# Altium project 红外发射模块.PrjPCB
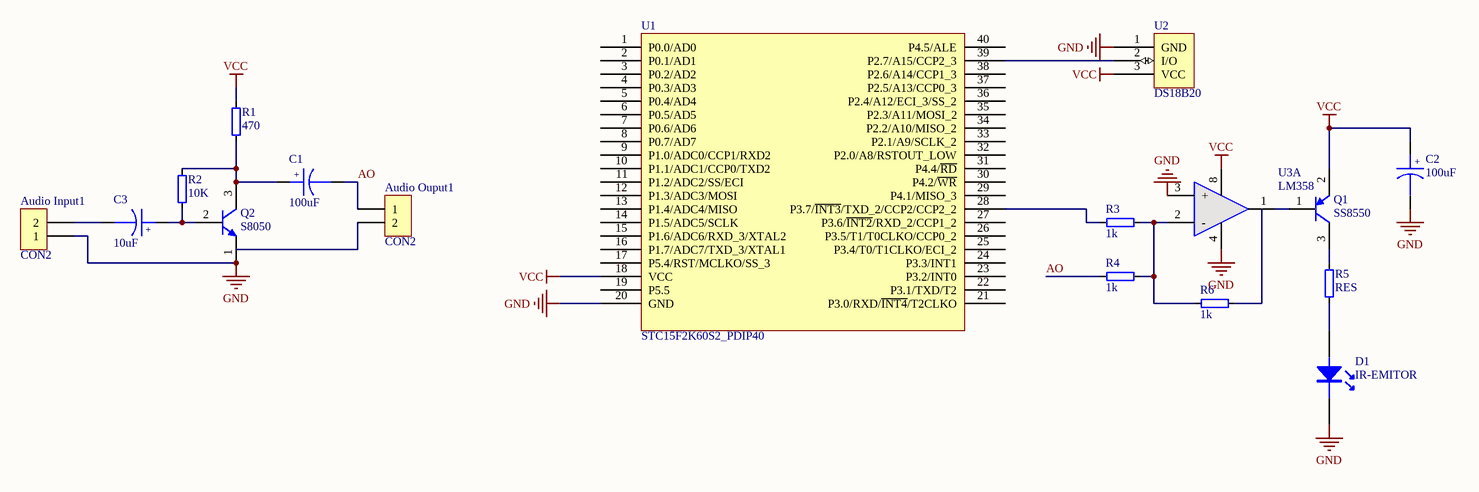
[diagram p0: 红外发射模块.SchDoc]
3 sheets, 35 parts. Net scope: global (net labels, ports and power ports of the same name join across sheets).
Sheets:
  红外发射模块.SchDoc
  红外接收模块.SchDoc
  中继转发.SchDoc

## Sheet 红外发射模块.SchDoc
size A4

### Parts
Audio_Input1  CON2
Audio_Ouput1  CON2
C1  100uF
C2  100uF
C3  10uF
D1  IR-EMITOR
Q1  SS8550  [SOT-23]
Q2  S8050  [TO-92A]
R1  470  [AXIAL0.3]
R2  10K  [AXIAL0.3]
R3  1k  [AXIAL0.3]
R4  1k  [AXIAL0.3]
R5  RES  [AXIAL0.3]
R6  1k  [AXIAL0.3]
U1  STC15F2K60S2_PDIP40  [DIP40]
U2  DS18B20
U3  LM358  [NSO8_N]  (part A of 2)

### Nets
GND: Audio_Input1.1 C2.2 D1.2 Q2.1(E) U1.20(GND) U2.1(GND) U3.3(+) U3.4(V-)
VCC: C2.1 Q1.2(E) R1.2 U1.18(VCC) U2.3(VCC) U3.8(V+)
AO: Audio_Ouput1.1 C1.2 R4.1
NetAudio_Input1_2: Audio_Input1.2 C3.2
NetC1_1: C1.1 Q2.3(C) R1.1 R2.2
NetC3_1: C3.1 Q2.2(B) R2.1
NetD1_1: D1.1 R5.1
NetQ1_1: Q1.1(B) U3.1(OUT1)
NetQ1_3: Q1.3(C) R5.2
NetR3_1: R3.1 U1.28(P3.7/~{INT3}/TXD_2/CCP2/CCP2_2)
NetR3_2: R3.2 R4.2 R6.1 U3.2(-)
NetU1_39: U1.39(P2.7/A15/CCP2_3) U2.2(I/O)

Not connected (* = marked no-connect by the designer): Audio_Ouput1 2; R6 2; U1 1(P0.0/AD0) 2(P0.1/AD1) 3(P0.2/AD2) 4(P0.3/AD3) 5(P0.4/AD4) 6(P0.5/AD5) 7(P0.6/AD6) 8(P0.7/AD7) 9(P1.0/ADC0/CCP1/RXD2) 10(P1.1/ADC1/CCP0/TXD2) 11(P1.2/ADC2/SS/ECI) 12(P1.3/ADC3/MOSI) 13(P1.4/ADC4/MISO) 14(P1.5/ADC5/SCLK) 15(P1.6/ADC6/RXD_3/XTAL2) 16(P1.7/ADC7/TXD_3/XTAL1) 17(P5.4/RST/MCLKO/SS_3) 19(P5.5) 21(P3.0/RXD/~{INT4}/T2CLKO) 22(P3.1/TXD/T2) 23(P3.2/INT0) 24(P3.3/INT1) 25(P3.4/T0/T1CLKO/ECI_2) 26(P3.5/T1/T0CLKO/CCP0_2) 27(P3.6/~{INT2}/RXD_2/CCP1_2) 29(P4.1/MISO_3) 30(P4.2/~{WR}) 31(P4.4/~{RD}) 32(P2.0/A8/RSTOUT_LOW) 33(P2.1/A9/SCLK_2) 34(P2.2/A10/MISO_2) 35(P2.3/A11/MOSI_2) 36(P2.4/A12/ECI_3/SS_2) 37(P2.5/A13/CCP0_3) 38(P2.6/A14/CCP1_3) 40(P4.5/ALE)

### Notes on the sheet
- (in symbol CAPACITOR POL) +

### Library data of the parts
Audio_Input1 Audio_Ouput1 = CON2: Connector
C1-C3 = CAPACITOR POL: Capacitor
Q1 = SS8550: PNP贴片三极管; Published: 8-Jun-2000; LatestRevisionDate: 15-Jan-2003; LatestRevisionNote: PCB Footprint 'BCY-W3/D4.7' replaced; DatasheetDocument: 1997; PackageDocument: Sep-1998; PackageReference: TO-92A; Publisher: Altium Limited; Code_JEDEC: TO-92A; ComponentLink1Description: Manufacturer Link; ComponentLink1URL: http://www.fairchildsemi.com/; ComponentLink2Description: Datasheet; ComponentLink2URL: http://www.fairchildsemi.com/ds/2N%2F2N3906.pdf
Q2 = S8050: NPN三极管; Published: 8-Jun-2000; LatestRevisionDate: 15-Jan-2003; LatestRevisionNote: PCB Footprint 'BCY-W3/D4.7' replaced; DatasheetDocument: 1997; PackageDocument: Sep-1998; PackageReference: TO-92A; Publisher: Altium Limited; Code_JEDEC: TO-92A; ComponentLink1Description: Manufacturer Link; ComponentLink1URL: http://www.fairchildsemi.com/; ComponentLink2Description: Datasheet; ComponentLink2URL: http://www.fairchildsemi.com/ds/2N%2F2N3904.pdf
R1-R4 R6 = RES
U3 = LM358: 双运放

## Sheet 红外接收模块.SchDoc
size A4
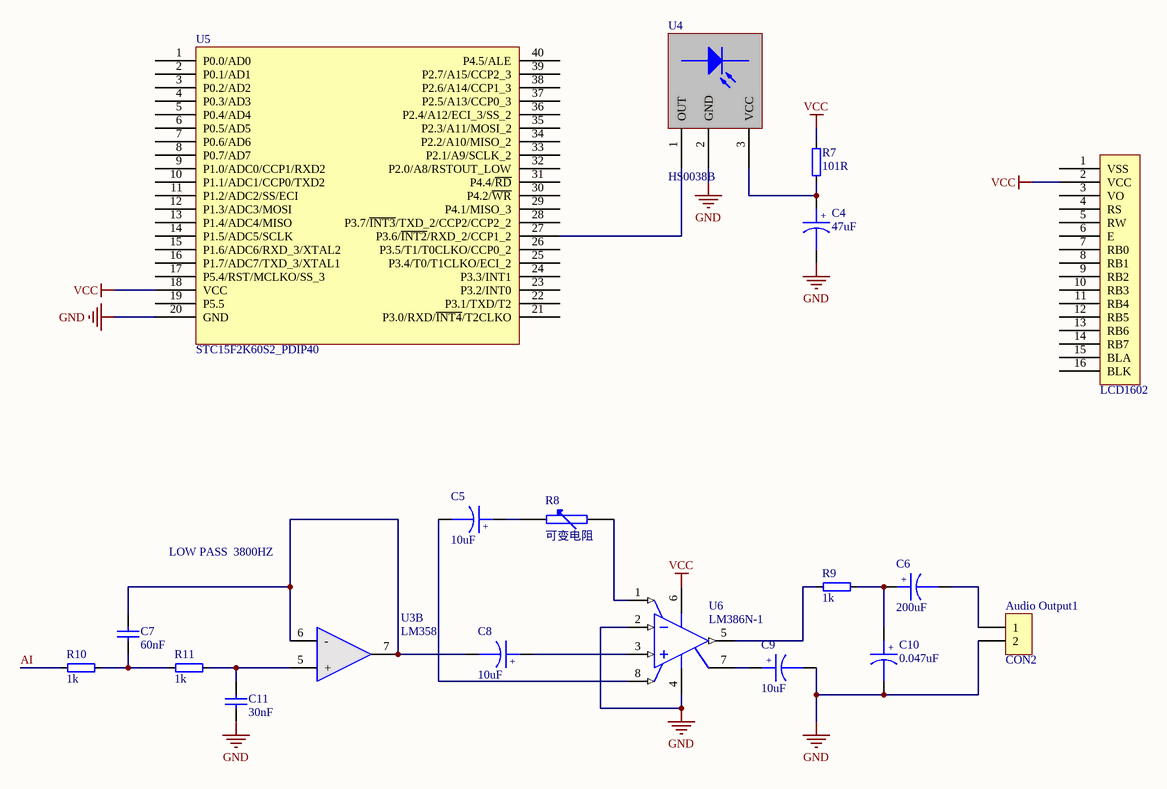
[diagram p1: 红外接收模块.SchDoc]

### Parts
?  LCD1602
Audio_Output1  CON2
C4  47uF
C5  10uF
C6  200uF
C7  value 60nF  [C-RAD-0603]  (hidden comment: Cap)
C8  10uF
C9  10uF
C10  0.047uF
C11  value 30nF  [C-RAD-0603]  (hidden comment: Cap)
R7  101R  [AXIAL0.3]
R8  可变电阻
R9  1k  [AXIAL0.3]
R10  1k  [AXIAL0.3]
R11  1k  [AXIAL0.3]
U3  LM358  [NSO8_N]  (part B of 2)
U4  HS0038B  [HS0038B]
U5  STC15F2K60S2_PDIP40  [DIP40]
U6  LM386N-1  [TI-P8]

### Nets
GND: Audio_Output1.2 C4.2 C9.2 C10.2 C11.1 U4.2(GND) U5.20(GND) U6.2(IN-) U6.4(GND)
VCC: ?.2(VCC) R7.1 U5.18(VCC) U6.6(VS)
AI: R10.1
NetAudio_Output1_1: Audio_Output1.1 C6.2
NetC4_1: C4.1 R7.2 U4.3(VCC)
NetC5_1: C5.1 R8.2
NetC5_2: C5.2 U6.8(GAIN)
NetC6_1: C6.1 C10.1 R9.2
NetC7_1: C7.1 R10.2 R11.1
NetC7_2: C7.2 C8.2 U3.6(-) U3.7(OUT2)
NetC8_1: C8.1 U6.3(IN+)
NetC9_1: C9.1 U6.7(BYPASS)
NetC11_2: C11.2 R11.2 U3.5(+)
NetR8_1: R8.1 U6.1(GAIN)
NetR9_1: R9.1 U6.5(VOUT)
NetU4_1: U4.1(OUT) U5.27(P3.6/~{INT2}/RXD_2/CCP1_2)

Not connected (* = marked no-connect by the designer): ? 1(VSS) 3(VO) 4(RS) 5(RW) 6(E) 7(RB0) 8(RB1) 9(RB2) 10(RB3) 11(RB4) 12(RB5) 13(RB6) 14(RB7) 15(BLA) 16(BLK); U5 1(P0.0/AD0) 2(P0.1/AD1) 3(P0.2/AD2) 4(P0.3/AD3) 5(P0.4/AD4) 6(P0.5/AD5) 7(P0.6/AD6) 8(P0.7/AD7) 9(P1.0/ADC0/CCP1/RXD2) 10(P1.1/ADC1/CCP0/TXD2) 11(P1.2/ADC2/SS/ECI) 12(P1.3/ADC3/MOSI) 13(P1.4/ADC4/MISO) 14(P1.5/ADC5/SCLK) 15(P1.6/ADC6/RXD_3/XTAL2) 16(P1.7/ADC7/TXD_3/XTAL1) 17(P5.4/RST/MCLKO/SS_3) 19(P5.5) 21(P3.0/RXD/~{INT4}/T2CLKO) 22(P3.1/TXD/T2) 23(P3.2/INT0) 24(P3.3/INT1) 25(P3.4/T0/T1CLKO/ECI_2) 26(P3.5/T1/T0CLKO/CCP0_2) 28(P3.7/~{INT3}/TXD_2/CCP2/CCP2_2) 29(P4.1/MISO_3) 30(P4.2/~{WR}) 31(P4.4/~{RD}) 32(P2.0/A8/RSTOUT_LOW) 33(P2.1/A9/SCLK_2) 34(P2.2/A10/MISO_2) 35(P2.3/A11/MOSI_2) 36(P2.4/A12/ECI_3/SS_2) 37(P2.5/A13/CCP0_3) 38(P2.6/A14/CCP1_3) 39(P2.7/A15/CCP2_3) 40(P4.5/ALE)

### Notes on the sheet
- LOW PASS  3800HZ
- (in symbol CAPACITOR POL) +

### Library data of the parts
Audio_Output1 = CON2: Connector
C4-C6 C8-C10 = CAPACITOR POL: Capacitor
C7 C11 = Cap: 无极性电容; Published: 8-Jun-2000; LatestRevisionDate: 17-Jul-2002; LatestRevisionNote: Re-released for DXP Platform.; PackageReference: RAD-0.3; Publisher: Altium Limited
R7 R9-R11 = RES
U3 = LM358: 双运放
U4 = HS0038B: 红外接收器
U6 = LM386N-1: Low Voltage Audio Power Amplifier, 0 to 70 degC, 8-pin DIP (P8); Manufacturer: Texas Instruments; Input Type: Analog; Max. Number of Speaker Outputs: 1; SubFamily: Mid/High-Power Amplifier; DatasheetVersion: SNAS545A; PackageVersion: 4040082/E, 04/2010; PackageReference: P8; PackageDescription: 8-Pin Plastic In-Line, Body 9.59 x 6.35 mm, Pitch 2.54 mm; Supplier 1: Digi-Key; Supplier Part Number 1: LM386N-1-ND; Supplier 2: Farnell; Supplier Part Number 2: 9488332; Supplier 3: Newark; Supplier Part Number 3: 92F293; Supplier 4: Mouser; Supplier Part Number 4: 926-LM386N-1; Mounting Technology: Through Hole; Code_JEDEC: MS-001; PartNumber: LM386N-1; ComponentLink1Description: Manufacturer URL; ComponentLink1URL: http://www.ti.com/; ComponentLink2Description: Datasheet; ComponentLink2URL: http://www.ti.com/general/docs/lit/getliterature.tsp?genericPartNumber=LM386&fileType=pdf; ComponentLink3Description: Package Specification; ComponentLink3URL: http://www.ti.com/litv/pdf/mpdi001b

## Sheet 中继转发.SchDoc
size A4

## Nets that join several sheets
GND: 红外发射模块 (8 pins), 红外接收模块 (9 pins)
VCC: 红外发射模块 (6 pins), 红外接收模块 (?.2 R7.1 U5.18 U6.6)